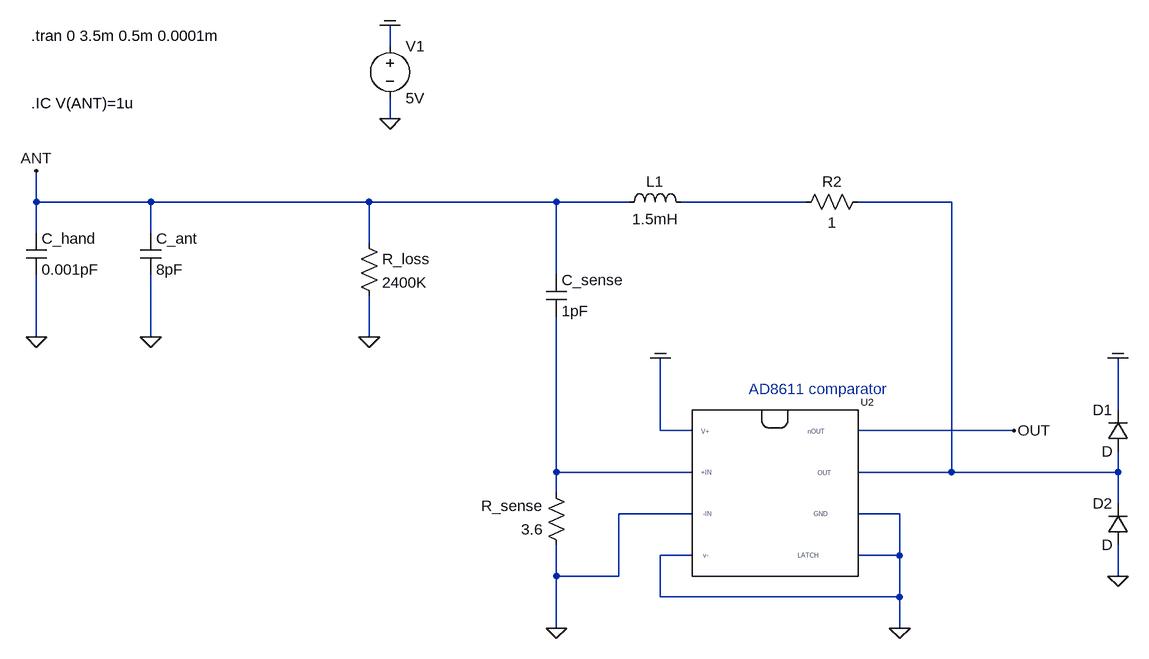
[diagram p0: schematic 2020_current_sense_simple_osc_v01.asc]
2020_current_sense_simple_osc_v01.asc, the LTspice schematic file:
Version 4
SHEET 1 3920 3076
WIRE -48 256 -48 224
WIRE -48 368 -48 336
WIRE -592 496 -592 448
WIRE -416 496 -592 496
WIRE -80 496 -416 496
WIRE 208 496 -80 496
WIRE 320 496 208 496
WIRE 592 496 400 496
WIRE 816 496 672 496
WIRE -592 544 -592 496
WIRE -416 544 -416 496
WIRE -80 560 -80 496
WIRE 208 608 208 496
WIRE -592 704 -592 608
WIRE -416 704 -416 608
WIRE -80 704 -80 640
WIRE 1072 816 1072 736
WIRE 368 848 368 736
WIRE 416 848 368 848
WIRE 912 848 672 848
WIRE 208 912 208 672
WIRE 416 912 208 912
WIRE 816 912 816 496
WIRE 816 912 672 912
WIRE 1072 912 1072 880
WIRE 1072 912 816 912
WIRE 208 944 208 912
WIRE 1072 960 1072 912
WIRE 416 976 304 976
WIRE 736 976 672 976
WIRE 416 1040 368 1040
WIRE 736 1040 736 976
WIRE 736 1040 672 1040
WIRE 208 1072 208 1024
WIRE 304 1072 304 976
WIRE 304 1072 208 1072
WIRE 1072 1072 1072 1024
WIRE 368 1104 368 1040
WIRE 736 1104 736 1040
WIRE 736 1104 368 1104
WIRE 208 1152 208 1072
WIRE 736 1152 736 1104
FLAG -48 368 0
FLAG -48 224 COM
FLAG -592 448 ANT
FLAG -592 704 0
FLAG -416 704 0
FLAG -80 704 0
FLAG 736 1152 0
FLAG 368 736 COM
FLAG 208 1152 0
FLAG 912 848 OUT
FLAG 1072 1072 0
FLAG 1072 736 COM
SYMBOL voltage -48 240 R0
WINDOW 123 0 0 Left 0
WINDOW 39 0 0 Left 0
SYMATTR InstName V1
SYMATTR Value 5V
SYMBOL ind 304 512 R270
WINDOW 0 32 56 VTop 2
WINDOW 3 5 56 VBottom 2
SYMATTR InstName L1
SYMATTR Value 1.5mH
SYMATTR SpiceLine Rser=32 Rpar=20Meg
SYMBOL cap -432 544 R0
SYMATTR InstName C_ant
SYMATTR Value 8pF
SYMBOL cap -608 544 R0
SYMATTR InstName C_hand
SYMATTR Value 0.001pF
SYMBOL res -96 544 R0
SYMATTR InstName R_loss
SYMATTR Value 2400K
SYMBOL cap 192 608 R0
SYMATTR InstName C_sense
SYMATTR Value 1pF
SYMBOL res 224 1040 R180
WINDOW 0 36 76 Left 2
WINDOW 3 36 40 Left 2
SYMATTR InstName R_sense
SYMATTR Value 3.6
SYMBOL ad8611 544 944 R0
SYMATTR InstName U2
SYMBOL res 688 480 R90
WINDOW 0 0 56 VBottom 2
WINDOW 3 32 56 VTop 2
SYMATTR InstName R2
SYMATTR Value 1
SYMBOL diode 1088 880 R180
WINDOW 0 24 64 Left 2
WINDOW 3 24 0 Left 2
SYMATTR InstName D1
SYMBOL diode 1088 1024 R180
WINDOW 0 24 64 Left 2
WINDOW 3 24 0 Left 2
SYMATTR InstName D2
TEXT -600 240 Left 2 !.tran 0 3.5m 0.5m 0.0001m
TEXT -600 344 Left 2 !.IC V(ANT)=1u
TEXT 504 784 Left 2 ;AD8611 comparator

The netlist it stands for:
* 2020_current_sense_simple_osc_v01.asc
V1 COM 0 5V
L1 ANT N001 1.5mH Rser=32 Rpar=20Meg
C_ant ANT 0 8pF
C_hand ANT 0 0.001pF
R_loss ANT 0 2400K
C_sense ANT N003 1pF
R_sense 0 N003 3.6
XU2 N003 0 COM 0 0 0 N002 OUT ad8611  ; pins +IN -IN V+ V- Latch GND OUT nOUT
R2 N002 N001 1
D1 N002 COM D
D2 0 N002 D
.model D D
.lib standard.dio
.tran 0 3.5m 0.5m 0.0001m
.IC V(ANT)=1u
* AD8611 comparator
.lib AD8611.cir
.backanno
.end